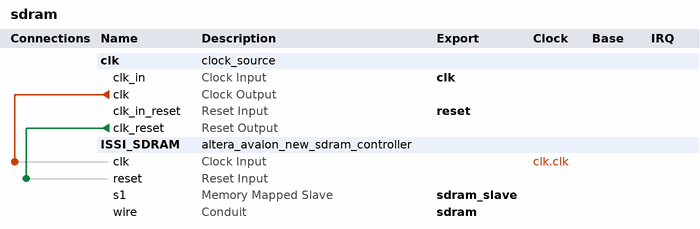
[diagram p0: system contents]
# Platform Designer (Qsys) system sdram, Cyclone 10 LP 10CL016YU256C8G
# Parameters at their usual value, and those the tool derives, are not listed.
package require -exact qsys 18.1
create_system sdram
set_project_property DEVICE_FAMILY {Cyclone 10 LP}
set_project_property DEVICE 10CL016YU256C8G

add_instance clk clock_source 18.1
set_instance_parameter_value clk clockFrequency 50000000

add_instance ISSI_SDRAM altera_avalon_new_sdram_controller 18.1
set_instance_parameter_value ISSI_SDRAM TAC 5.5
set_instance_parameter_value ISSI_SDRAM TRCD 20.0
set_instance_parameter_value ISSI_SDRAM TRP 20.0
set_instance_parameter_value ISSI_SDRAM casLatency 3
set_instance_parameter_value ISSI_SDRAM columnWidth 8
set_instance_parameter_value ISSI_SDRAM dataWidth 16
set_instance_parameter_value ISSI_SDRAM generateSimulationModel true
set_instance_parameter_value ISSI_SDRAM model single_Micron_MT48LC4M32B2_7_chip
set_instance_parameter_value ISSI_SDRAM numberOfBanks 4
set_instance_parameter_value ISSI_SDRAM numberOfChipSelects 1
set_instance_parameter_value ISSI_SDRAM powerUpDelay 100.0
set_instance_parameter_value ISSI_SDRAM refreshPeriod 15.625
set_instance_parameter_value ISSI_SDRAM rowWidth 12

# connections
add_connection clk.clk ISSI_SDRAM.clk clock
add_connection clk.clk_reset ISSI_SDRAM.reset reset

# exported interfaces
add_interface clk clock sink
set_interface_property clk EXPORT_OF clk.clk_in
add_interface reset reset sink
set_interface_property reset EXPORT_OF clk.clk_in_reset
add_interface sdram conduit end
set_interface_property sdram EXPORT_OF ISSI_SDRAM.wire
add_interface sdram_slave avalon slave
set_interface_property sdram_slave EXPORT_OF ISSI_SDRAM.s1

set_interconnect_requirement {$system} qsys_mm.clockCrossingAdapter HANDSHAKE
set_interconnect_requirement {$system} qsys_mm.enableEccProtection FALSE
set_interconnect_requirement {$system} qsys_mm.insertDefaultSlave FALSE
set_interconnect_requirement {$system} qsys_mm.maxAdditionalLatency 1

save_system sdram.qsys
